# Altium schematic sheet PAGE2-BLE, POWER, LORA.SchDoc (part 1 of 3)
size A3; DocumentNumber: 2; SheetNumber: 2; SheetTotal: 2
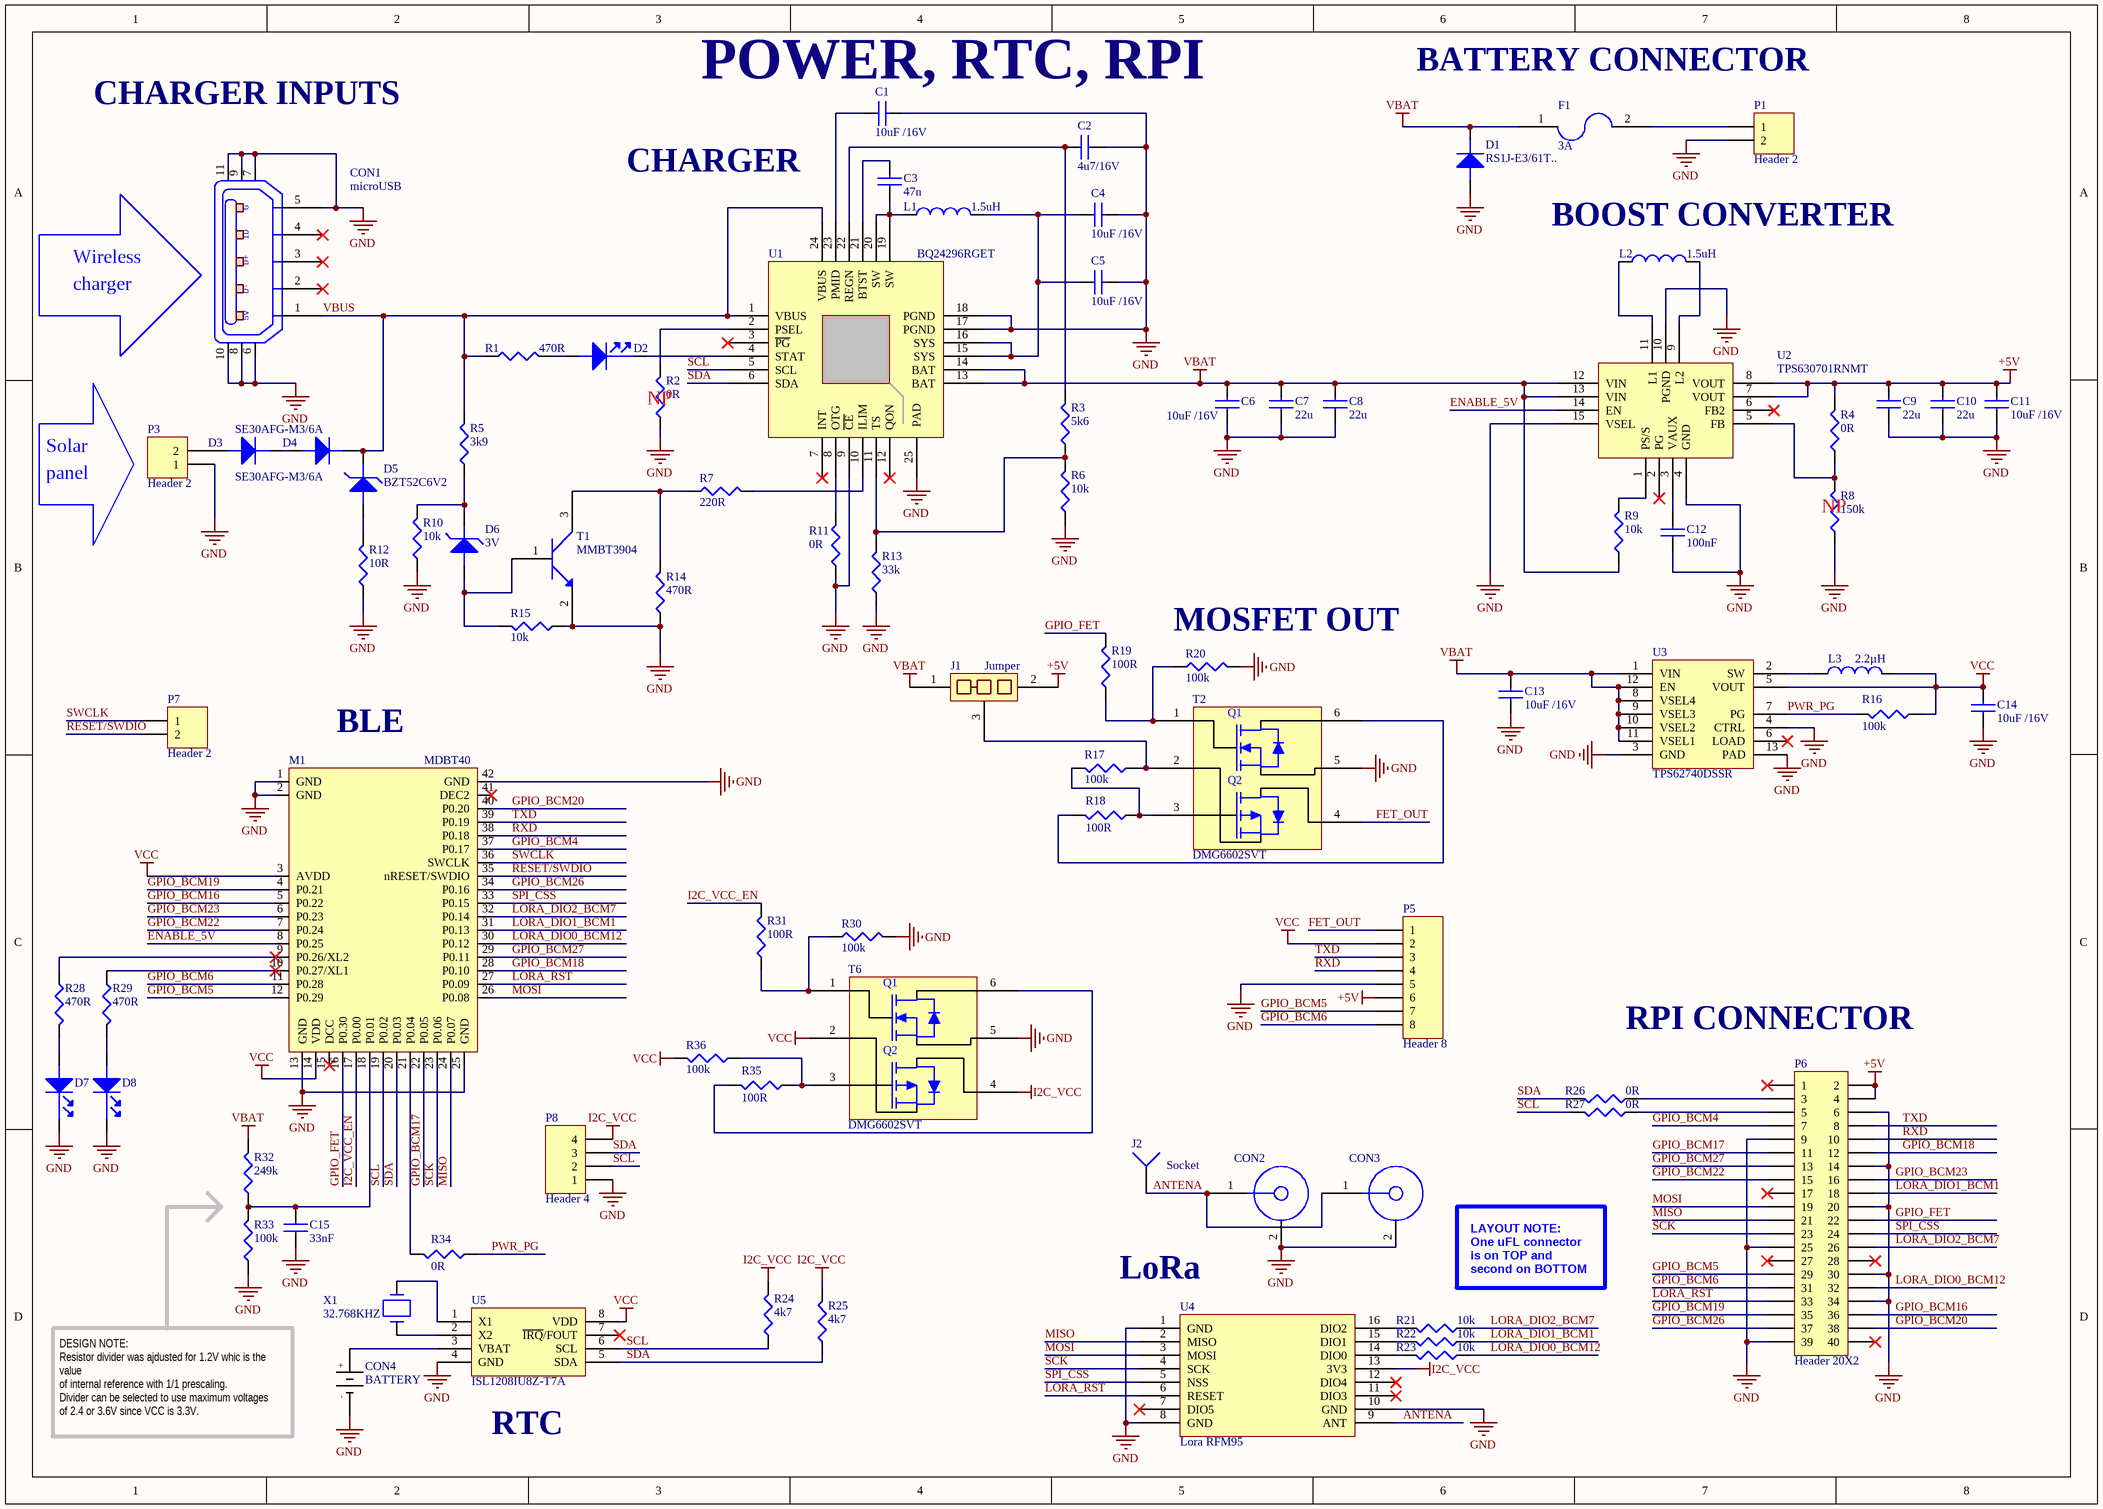
[diagram p0: PAGE2-BLE, POWER, LORA.SchDoc]

## Parts
C1  10uF /16V  [CAP0805]
C2  4u7/16V  [CAP0603]
C3  47n  [CAP0603]
C4  10uF /16V  [CAP0805]
C5  10uF /16V  [CAP0805]
C6  10uF /16V  [CAP0805]
C7  22u  [CAP0805]
C8  22u  [CAP0805]
C9  22u  [CAP0805]
C10  22u  [CAP0805]
C11  10uF /16V  [CAP0805]
C12  100nF  [CAP0603]
C13  10uF /16V  [CAP0805]
C14  10uF /16V  [CAP0805]
C15  33nF  [CAP0603]
CON1  microUSB  [microUSB-CHINA]  (no BOM)
CON2  U.FL-R-SMT-1(10)  [uFL SMD connector]  (value not drawn)
CON3  U.FL-R-SMT-1(10)  [uFL SMD connector]  (value not drawn)
CON4  BATTERY  [1066_1066(Primary)]
D1  RS1J-E3/61T..  [SMC/DO-214AC]
D2  LED RED  [LED0603]  (value not drawn)
D3  SE30AFG-M3/6A  [SODFL127P600-8N]
D4  SE30AFG-M3/6A  [SODFL127P600-8N]
D5  BZT52C6V2  [SOD123]
D6  3V  [SOD-323 2L]
D7  LED RED  [LED0603]  (value not drawn)
D8  LED RED  [LED0603]  (value not drawn)
F1  3A  [Chip2PinSM127P600-8N]
J1  Jumper  [JUMPER_NC]
J2  Socket  [PIN1]  (no BOM)
L1  1.5uH  [FDSD0402]
L2  1.5uH  [FDSD0402]
L3  2.2µH  [INDC2214X15N]
M1  MDBT40  [PCB_MDBT40_10X18]
P1  Header 2  [HDR1X2]  (no BOM)
P3  Header 2  [HDR1X2]  (no BOM)
P5  Header 8  [HDR1X8]  (no BOM)
P6  Header 20X2  [HDR2X20]  (no BOM)
P7  Header 2  [HDR1X2]  (no BOM)
P8  Header 4  [HDR1X4]
R1  470R  [RES0603]
R2  0R  [RES0603]
R3  5k6  [RES0603]
R4  0R  [RES0603]
R5  3k9  [RES0603]
R6  10k  [RES0603]
R7  220R  [RES0603]
R8  150k  [RES0603]
R9  10k  [RES0603]
R10  10k  [RES0603]
R11  0R  [RES0603]
R12  10R  [RES0603]
R13  33k  [RES0603]
R14  470R  [RES0603]
R15  10k  [RES0603]
R16  100k  [RES0603]
R17  100k  [RES0603]
R18  100R  [RES0603]
R19  100R  [RES0603]
R20  100k  [RES0603]
R21  10k  [RES0603]
R22  10k  [RES0603]
R23  10k  [RES0603]
R24  4k7  [RES0603]
R25  4k7  [RES0603]
R26  0R  [RES0603]
R27  0R  [RES0603]
R28  470R  [RES0603]
R29  470R  [RES0603]
R30  100k  [RES0603]
R31  100R  [RES0603]
R32  249k  [RES0603]
R33  100k  [RES0603]
R34  0R  [RES0603]
R35  100R  [RES0603]
R36  100k  [RES0603]
T1  MMBT3904  [SOT23127P600-8N]
T2  DMG6602SVT  [TSOT26]
T6  DMG6602SVT  [TSOT26]
U1  BQ24296RGET  [QFN4x4]
U2  TPS630701RNMT  [VQFN TPS]
U3  TPS62740DSSR  [SON50P200X265_HS-13N]
U4  Lora RFM95  [Lora_module1]
U5  ISL1208IU8Z-T7A  [TSOP65P500X110-8N]
X1  32.768KHZ  [LFXTAL009678]

## Nets
+5V: C9.2 C10.2 C11.2 J1.2 P5.6 P6.2 P6.4 R4.2 U2.7(VOUT) U2.8(VOUT)
GND: C1.2 C2.2 C4.2 C5.2 C6.1 C7.1 C8.1 C9.1 C10.1 C11.1 C12.1 C13.1 C14.1 C15.1 CON1.5(P5) CON1.6 CON1.7 CON1.8 CON1.9 CON1.10 CON1.11 CON2.2 CON3.2 CON4.NEG D1.2(ANODE) D7.1(cathode) D8.1(cathode) M1.1(GND) M1.2(GND) M1.13(GND) M1.25(GND) M1.42(GND) P1.2 P3.1 P5.5 P6.6 P6.9 P6.14 P6.20 P6.25 P6.30 P6.34 P6.39 P8.1 R2.1 R6.1 R8.1 R10.1 R11.1 R12.1 R13.1 R14.1 R15.1 R20.2 R30.2 R33.1 T1.2 T2.5(S1) T6.5(S1) U1.9(~{CE}) U1.17(PGND) U1.18(PGND) U1.25(PAD) U2.4(GND) U2.10(PGND) U2.15(VSEL) U3.3(GND) U3.4(CTRL) U3.13(PAD) U4.1(GND) U4.8(GND) U4.10(GND) U5.4(GND)
I2C_VCC: P8.4 R24.2 R25.2 T6.4(D2) U4.13(3V3)
VBAT: C6.2 C7.2 C8.2 C13.2 D1.1(cathode) F1.1 J1.1 R9.1 R32.2 U1.13(BAT) U1.14(BAT) U2.12(VIN) U2.13(VIN) U3.1(VIN) U3.8(VSEL4) U3.9(VSEL3) U3.10(VSEL2) U3.11(VSEL1) U3.12(EN)
VCC: C14.2 L3.2 M1.3(AVDD) M1.14(VDD) P5.2 R16.1 R36.2 T6.2(S2) U3.5(VOUT) U5.8(VDD)
ANTENA: CON2.1 CON3.1 J2.1 U4.9(ANT)
ENABLE_5V: M1.8(P0.25) U2.14(EN)
FET_OUT: P5.1 T2.4(D2)
GPIO_BCM4: M1.37(P0.17) P6.7
GPIO_BCM5: M1.12(P0.29) P5.7 P6.29
GPIO_BCM6: M1.11(P0.28) P5.8 P6.31
GPIO_BCM16: M1.5(P0.22) P6.36
GPIO_BCM17: M1.22(P0.05) P6.11
GPIO_BCM18: M1.28(P0.10) P6.12
GPIO_BCM19: M1.4(P0.21) P6.35
GPIO_BCM20: M1.40(P0.20) P6.38
GPIO_BCM22: M1.7(P0.24) P6.15
GPIO_BCM23: M1.6(P0.23) P6.16
GPIO_BCM26: M1.34(P0.16) P6.37
GPIO_BCM27: M1.29(P0.11) P6.13
GPIO_FET: M1.16(P0.30) P6.22 R19.2
I2C_VCC_EN: M1.17(P0.00) R31.2
LORA_DIO0_BCM12: M1.30(P0.12) P6.32 R23.1
LORA_DIO1_BCM1: M1.31(P0.13) P6.18 R22.1
LORA_DIO2_BCM7: M1.32(P0.14) P6.26 R21.1
LORA_RST: M1.27(P0.09) P6.33 U4.6(RESET)
MISO: M1.24(P0.07) P6.21 U4.2(MISO)
MOSI: M1.26(P0.08) P6.19 U4.3(MOSI)
PWR_PG: R16.2 R34.1 U3.7(PG)
~{RESET}/SWDIO: M1.35(nRESET/SWDIO) P7.2
RXD: M1.38(P0.18) P5.4 P6.10
SCK: M1.23(P0.06) P6.23 U4.4(SCK)
SCL: M1.19(P0.02) P8.2 R24.1 R27.2 U1.5(SCL) U5.6(SCL)
SDA: M1.20(P0.03) P8.3 R25.1 R26.2 U1.6(SDA) U5.5(SDA)
SPI_CSS: M1.33(P0.15) P6.24 U4.5(NSS)
SWCLK: M1.36(SWCLK) P7.1
TXD: M1.39(P0.19) P5.3 P6.8
VBUS: CON1.1(P1) D4.1(cathode) D5.1(cathode) R1.1 R5.2 U1.1(VBUS) U1.24(VBUS)
NetC1_1: C1.1 U1.23(PMID)
NetC2_1: C2.1 R3.2 U1.22(REGN)
NetC3_1: C3.1 L1.1 U1.19(SW) U1.20(SW)
NetC3_2: C3.2 U1.21(BTST)
NetC4_1: C4.1 C5.1 L1.2 U1.15(SYS) U1.16(SYS)
NetC12_2: C12.2 U2.3(VAUX)
NetC15_2: C15.2 M1.18(P0.01) R32.1 R33.2
NetCON4_POS: CON4.POS U5.3(VBAT)
NetD2_1: D2.1(cathode) U1.4(STAT)
NetD2_2: D2.2(ANODE) R1.2
NetD3_1: D3.1(cathode) D4.2(ANODE)
NetD3_2: D3.2(ANODE) P3.2
NetD5_2: D5.2(ANODE) R12.2
NetD6_1: D6.1(cathode) R5.1 R10.2
NetD6_2: D6.2(ANODE) R15.2 T1.1
NetD7_2: D7.2(ANODE) R28.2
NetD8_2: D8.2(ANODE) R29.2
NetF1_2: F1.2 P1.1
NetJ1_3: J1.3 R17.1 T2.2(S2)
NetL2_1: L2.1 U2.11(L1)
NetL2_2: L2.2 U2.9(L2)
NetL3_1: L3.1 U3.2(SW)
NetM1_9: M1.9(P0.26/XL2) R28.1
NetM1_10: M1.10(P0.27/XL1) R29.1
NetM1_21: M1.21(P0.04) R34.2
NetP6_3: P6.3 R26.1
NetP6_5: P6.5 R27.1
NetR2_2: R2.2 U1.2(PSEL)
NetR3_1: R3.1 R6.2 R13.2 U1.11(TS)
NetR4_1: R4.1 R8.2 U2.5(FB)
NetR7_1: R7.1 R14.2 T1.3
NetR7_2: R7.2 U1.10(ILIM)
NetR9_2: R9.2 U2.1(PS/S)
NetR11_2: R11.2 U1.8(OTG)
NetR17_2: R17.2 R18.1 T2.3(G2)
NetR18_2: R18.2 T2.6(D1)
NetR19_1: R19.1 R20.1 T2.1(G1)
NetR21_2: R21.2 U4.16(DIO2)
NetR22_2: R22.2 U4.15(DIO1)
NetR23_2: R23.2 U4.14(DIO0)
NetR30_1: R30.1 R31.1 T6.1(G1)
NetR35_1: R35.1 R36.1 T6.3(G2)
NetR35_2: R35.2 T6.6(D1)
NetU5_1: U5.1(X1) X1.2
NetU5_2: U5.2(X2) X1.1

Not connected (* = marked no-connect by the designer): CON1 2(P2)* 3(P3)* 4(P4)*; M1 15(DCC)* 41(DEC2)*; P6 1* 17* 27* 28* 40*; U1 3(~{PG})* 7(INT)* 12(QON)*; U2 2(PG)* 6(FB2)*; U3 6(LOAD)*; U4 7(DIO5)* 11(DIO3)* 12(DIO4)*; U5 7(~{IRQ}/FOUT)*

## Notes on the sheet
- CHARGER INPUTS
- (near C1) POWER, RTC, RPI
- BATTERY CONNECTOR
- CHARGER
- (near L2) BOOST CONVERTER
- Wireless
- charger
- Solar
- (near R2) NP
- panel
- (near R8) NP
- (near R20) MOSFET OUT
- (near M1) BLE
- RPI CONNECTOR
- (near U4) LoRa
- LAYOUT NOTE:
  One uFL connector is on TOP and second on BOTTOM
- DESIGN NOTE:
  Resistor divider was ajdusted for 1.2V whic is the value
  of internal reference with 1/1 prescaling.
  Divider can be selected to use maximum voltages
  of 2.4 or 3.6V since VCC is 3.3V.
- (near U5) RTC
- (in symbol 1066) +; -
- (in symbol DMG6602SVT) Q1; Q2
- (in symbol Micro USB CHINA 1) G; ID; D+; D-; 5V